# EAGLE design mainboard (EAGLE 5.07)

## Sheet 1 of 4
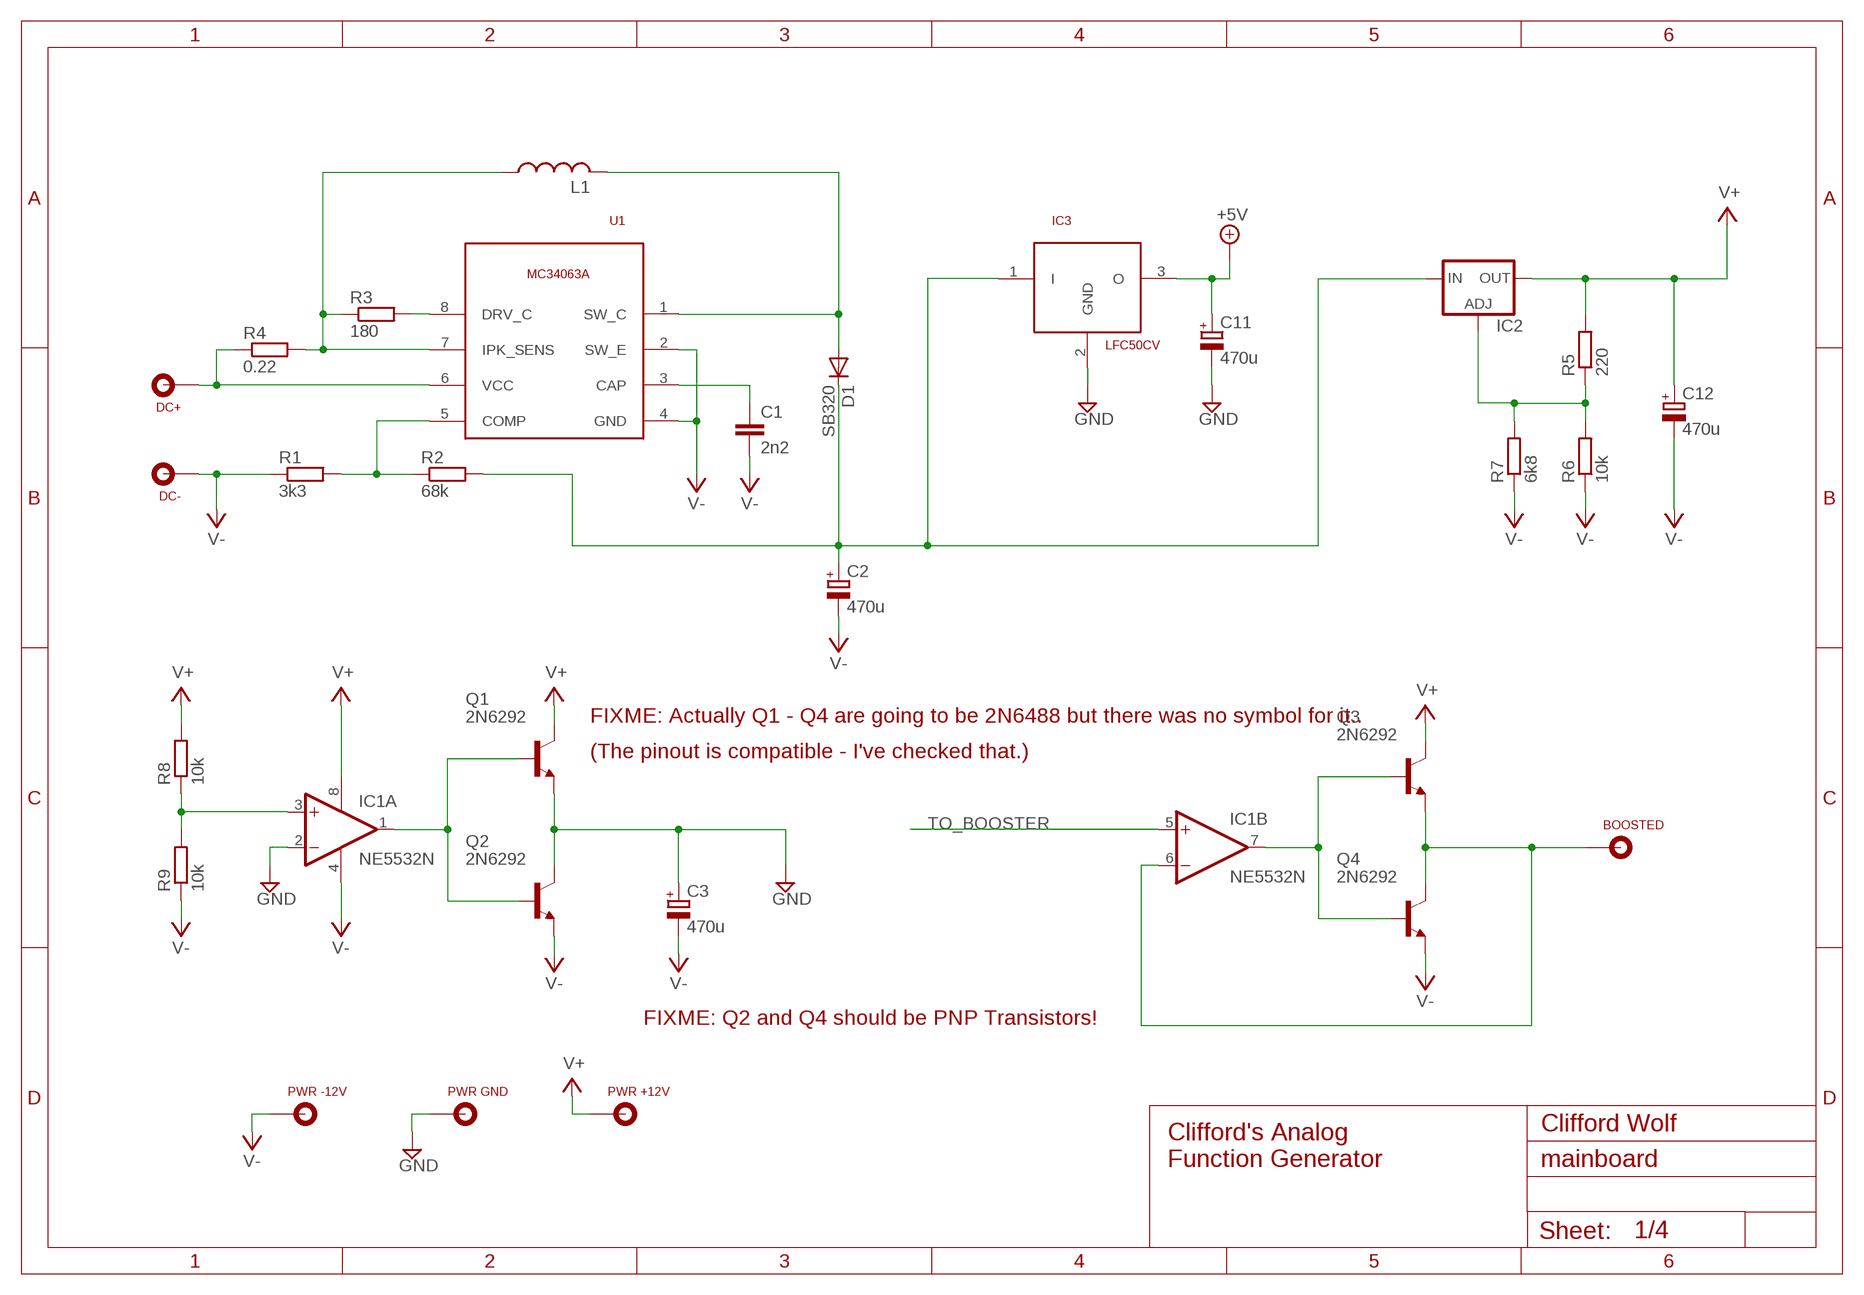
[diagram p0: schematic, sheet 1]

### Parts
C1  2n2  C-EU050-025X075  [C050-025X075]
C2  470u  CPOL-EUE5-10.5  [E5-10,5]
C3  470u  CPOL-EUE5-10.5  [E5-10,5]
C11  470u  CPOL-EUE5-10.5  [E5-10,5]
C12  470u  CPOL-EUE5-10.5  [E5-10,5]
CONN1  DC+  LABCONN  [LABCONN]
CONN2  DC-  LABCONN  [LABCONN]
CONN3  BOOSTED  LABCONN  [LABCONN]
CONN4  PWR -12V  LABCONN  [LABCONN]
CONN5  PWR GND  LABCONN  [LABCONN]
CONN6  PWR +12V  LABCONN  [LABCONN]
D1  SB320  [DO201-15]
IC1  NE5532N  [DIL08]
IC2  LM317TL  [317TL]
IC3  LFC50CV  [TO220L1]
L1  L-US0207/12  [0207/12]
Q1  2N6292  [TO220]
Q2  2N6292  [TO220]
Q3  2N6292  [TO220]
Q4  2N6292  [TO220]
R1  3k3  R-EU_0207/7  [0207/7]
R2  68k  R-EU_0207/7  [0207/7]
R3  180  R-EU_0207/7  [0207/7]
R4  0.22  R-EU_0207/7  [0207/7]
R5  220  R-EU_0207/7  [0207/7]
R6  10k  R-EU_0207/7  [0207/7]
R7  6k8  R-EU_0207/7  [0207/7]
R8  10k  R-EU_0207/7  [0207/7]
R9  10k  R-EU_0207/7  [0207/7]
U1  MC34063A  [DIL08]

### Nets
+5V [power]: C11.+ IC3.3(O) ; also sheet 3,4
GND [power]: C3.+ C11.- CONN5.P$1 IC1.2(A:-IN) IC3.2(GND) Q1.3(E) Q2.2(C) ; also sheet 2,3,4
N$2: R1.2 R2.1 U1.5(COMP)
N$3 [power]: CONN1.P$1 R4.1 U1.6(VCC)
N$4 [power]: L1.1 R3.1 R4.2 U1.7(IPK_SENS)
N$5: R3.2 U1.8(DRV_C)
N$6 [power]: D1.A L1.2 U1.1(SW_C)
N$8: C1.1 U1.3(CAP)
N$9: IC2.1(ADJ) R5.1 R6.2 R7.2
N$10 [power]: C2.+ D1.C IC2.3(IN) IC3.1(I) R2.2
N$11: IC1.3(A:+IN) R8.1 R9.2
N$12: IC1.1(A:OUT) Q1.1(B) Q2.1(B)
N$13: CONN3.P$1 IC1.6(B:-IN) Q3.3(E) Q4.2(C)
N$15: IC1.7(B:OUT) Q3.1(B) Q4.1(B)
TO_BOOSTER: IC1.5(B:+IN) ; also sheet 2
V+ [power]: C12.+ CONN6.P$1 IC1.8(P:V+) IC2.2(OUT) Q1.2(C) Q3.2(C) R5.2 R8.2 ; also sheet 2,3,4
V- [power]: C1.2 C2.- C3.- C12.- CONN2.P$1 CONN4.P$1 IC1.4(P:V-) Q2.3(E) Q4.3(E) R1.1 R6.1 R7.1 R9.1 U1.2(SW_E) U1.4(GND) ; also sheet 2,3,4

### Notes on the sheet
- FIXME: Actually Q1 - Q4 are going to be 2N6488 but there was no symbol for it..
- (The pinout is compatible - I've checked that.)
- FIXME: Q2 and Q4 should be PNP Transistors!
- Clifford Wolf
- Clifford's Analog
- Function Generator

## Sheet 2 of 4
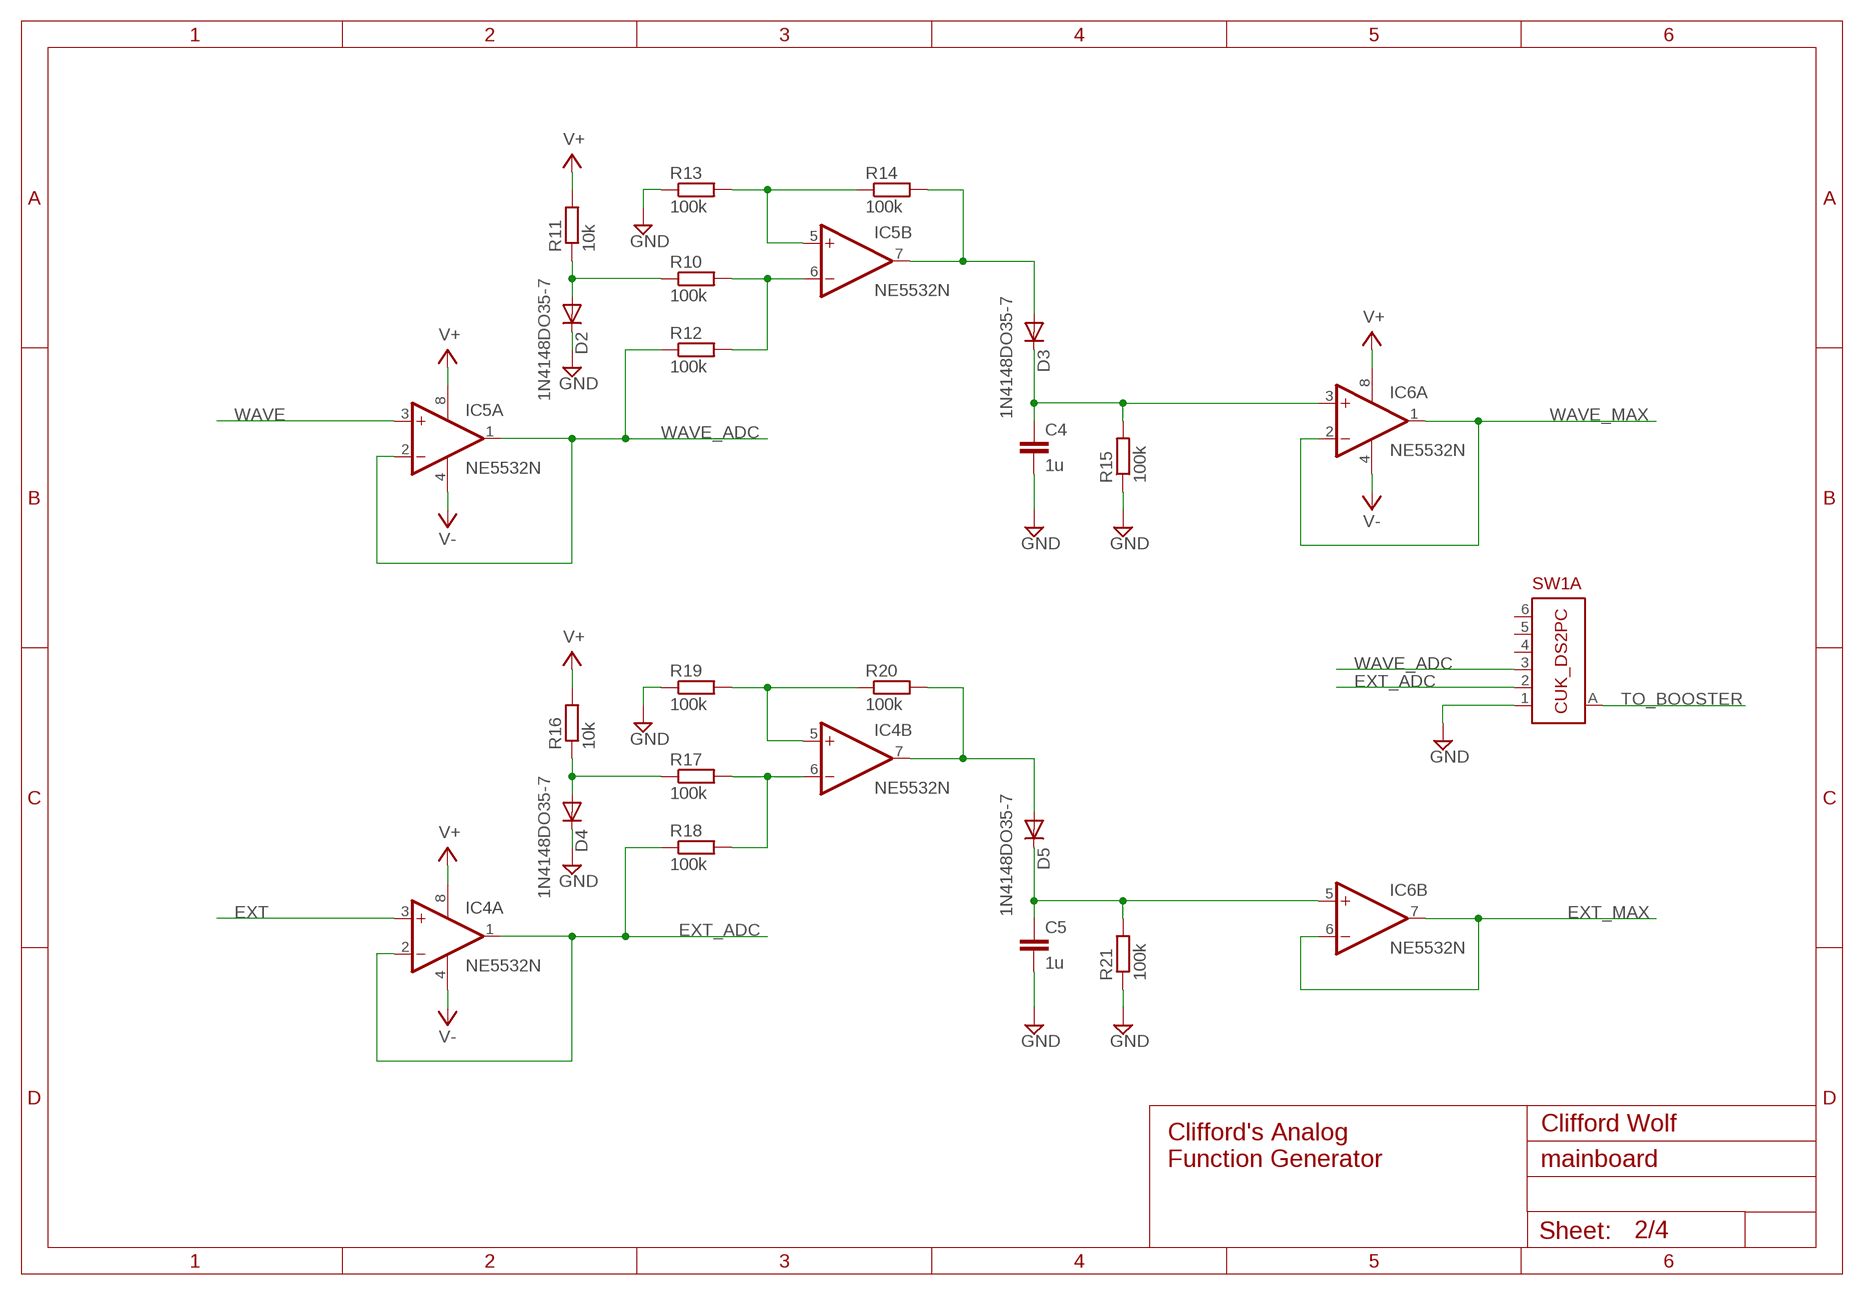
[diagram p1: schematic, sheet 2]

### Parts
C4  1u  C-EU050-025X075  [C050-025X075]
C5  1u  C-EU050-025X075  [C050-025X075]
D2  1N4148DO35-7  [DO35-7]
D3  1N4148DO35-7  [DO35-7]
D4  1N4148DO35-7  [DO35-7]
D5  1N4148DO35-7  [DO35-7]
IC4  NE5532N  [DIL08]
IC5  NE5532N  [DIL08]
IC6  NE5532N  [DIL08]
R10  100k  R-EU_0207/7  [0207/7]
R11  10k  R-EU_0207/7  [0207/7]
R12  100k  R-EU_0207/7  [0207/7]
R13  100k  R-EU_0207/7  [0207/7]
R14  100k  R-EU_0207/7  [0207/7]
R15  100k  R-EU_0207/7  [0207/7]
R16  10k  R-EU_0207/7  [0207/7]
R17  100k  R-EU_0207/7  [0207/7]
R18  100k  R-EU_0207/7  [0207/7]
R19  100k  R-EU_0207/7  [0207/7]
R20  100k  R-EU_0207/7  [0207/7]
R21  100k  R-EU_0207/7  [0207/7]
SW1  CUK_DS2PC  [CUK_DS2PC]

### Nets
EXT: IC4.3(A:+IN) ; also sheet 4
EXT_ADC: IC4.1(A:OUT) IC4.2(A:-IN) R18.1 SW1.2(A:IN2) ; also sheet 4
EXT_MAX: IC6.6(B:-IN) IC6.7(B:OUT) ; also sheet 4
GND [power]: C4.2 C5.2 D2.C D4.C R13.1 R15.1 R19.1 R21.1 SW1.1(A:IN1) ; also sheet 1,3,4
N$17: D2.A R10.1 R11.1
N$18: IC5.6(B:-IN) R10.2 R12.2
N$20: IC5.5(B:+IN) R13.2 R14.1
N$21: D3.A IC5.7(B:OUT) R14.2
N$22: C4.1 D3.C IC6.3(A:+IN) R15.2
N$26: D4.A R16.1 R17.1
N$27: IC4.6(B:-IN) R17.2 R18.2
N$28: IC4.5(B:+IN) R19.2 R20.1
N$29: D5.A IC4.7(B:OUT) R20.2
N$30: C5.1 D5.C IC6.5(B:+IN) R21.2
TO_BOOSTER: SW1.A(A:OUT) ; also sheet 1
V+ [power]: IC4.8(P:V+) IC5.8(P:V+) IC6.8(P:V+) R11.2 R16.2 ; also sheet 1,3,4
V- [power]: IC4.4(P:V-) IC5.4(P:V-) IC6.4(P:V-) ; also sheet 1,3,4
WAVE: IC5.3(A:+IN) ; also sheet 4
WAVE_ADC: IC5.1(A:OUT) IC5.2(A:-IN) R12.1 SW1.3(A:IN3) ; also sheet 4
WAVE_MAX: IC6.1(A:OUT) IC6.2(A:-IN) ; also sheet 4
Unconnected: SW1.4(A:IN4) SW1.5(A:IN5) SW1.6(A:IN6) SW1.7(C:IN1) SW1.8(C:IN2) SW1.9(C:IN3) SW1.10(C:IN4) SW1.11(C:IN5) SW1.12(C:IN6) SW1.C(C:OUT)

### Notes on the sheet
- Clifford Wolf
- Clifford's Analog
- Function Generator

## Sheet 3 of 4
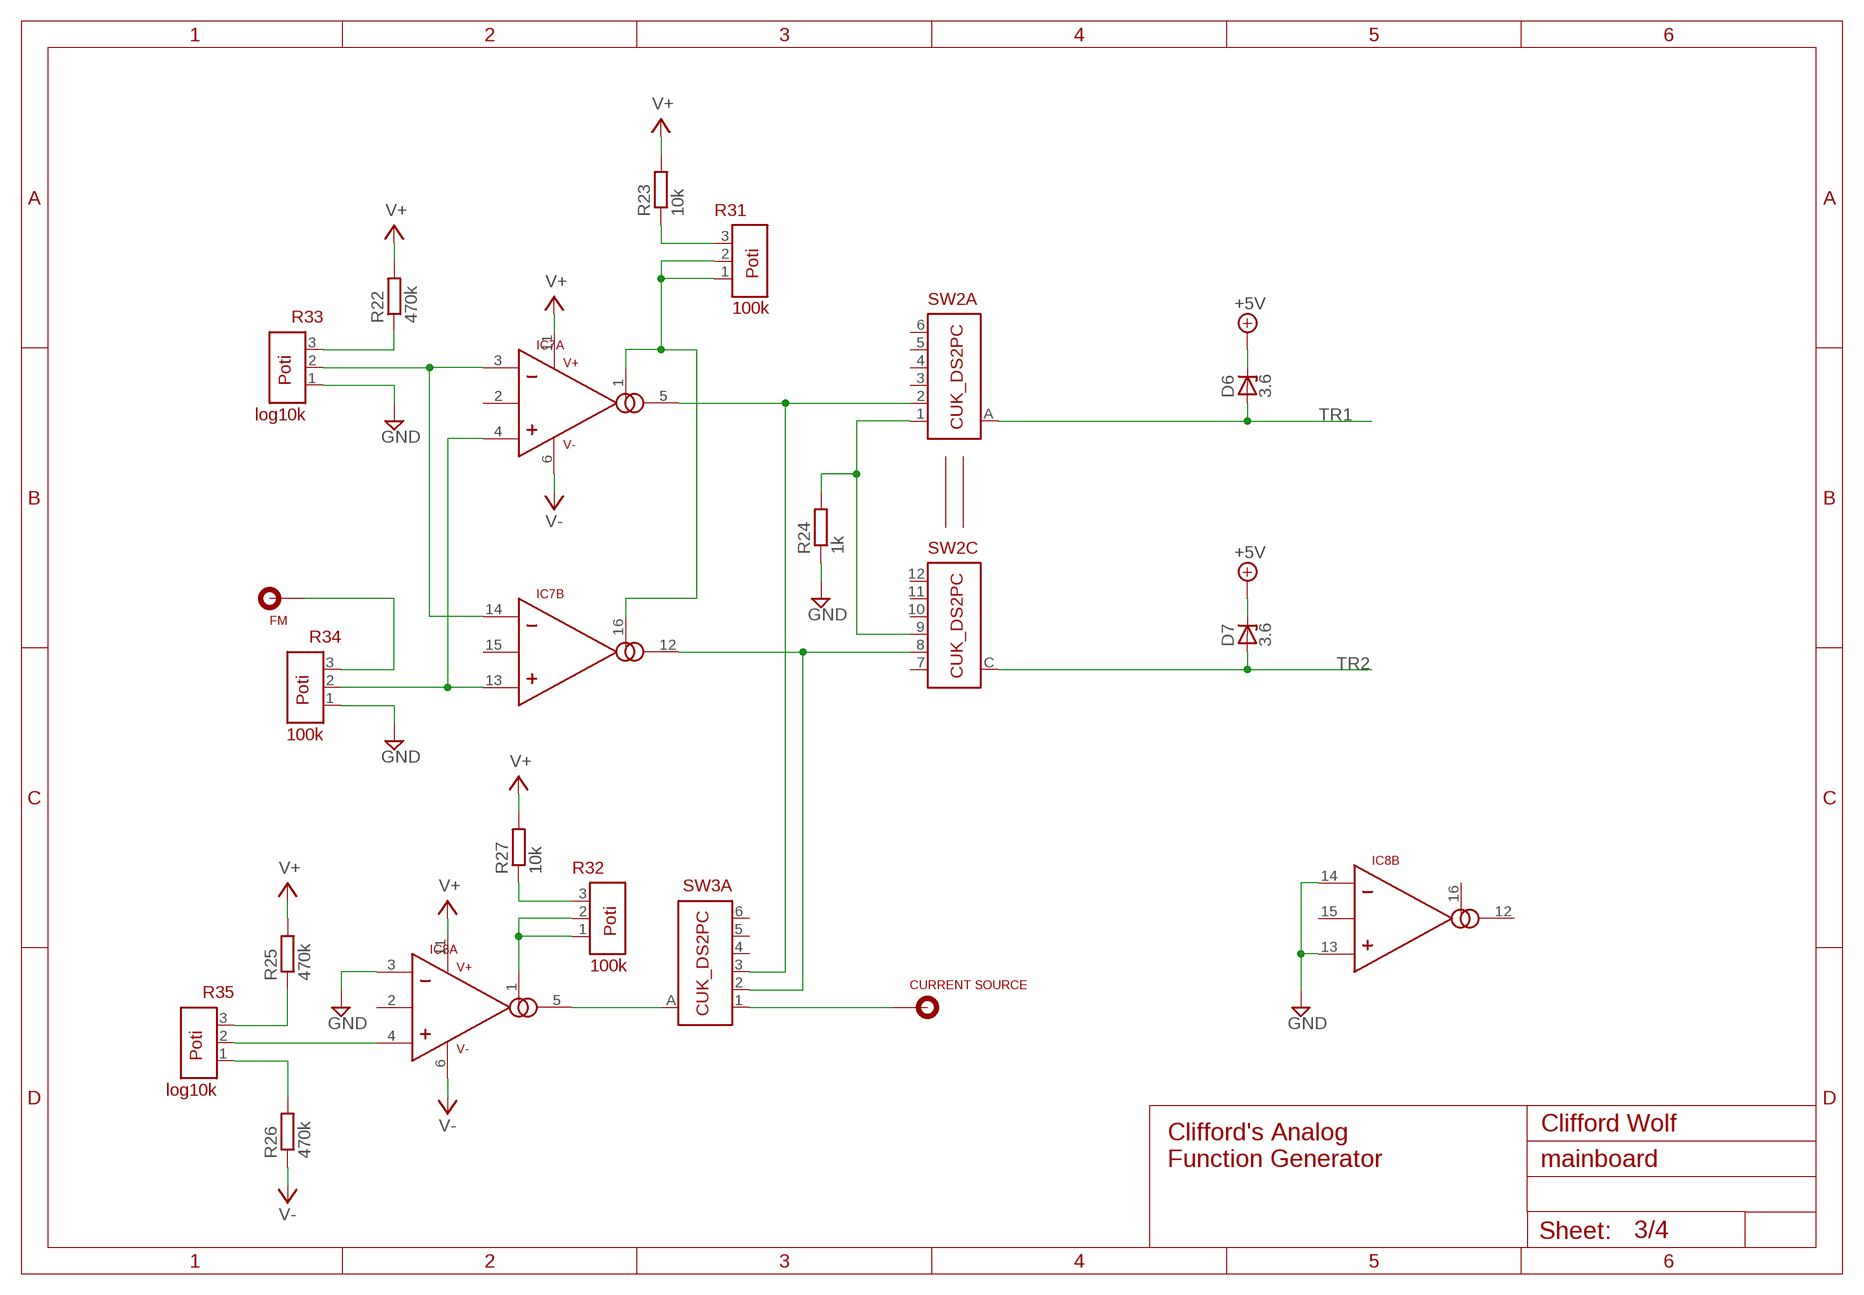
[diagram p2: schematic, sheet 3]

### Parts
CONN7  FM  LABCONN  [LABCONN]
CONN8  CURRENT SOURCE  LABCONN  [LABCONN]
D6  3.6  ZENER-DIODEZD-7.5  [ZDIO-7.5]
D7  3.6  ZENER-DIODEZD-7.5  [ZDIO-7.5]
IC7  LM13700  [DIL16]
IC8  LM13700  [DIL16]
R22  470k  R-EU_0207/7  [0207/7]
R23  10k  R-EU_0207/7  [0207/7]
R24  1k  R-EU_0207/7  [0207/7]
R25  470k  R-EU_0207/7  [0207/7]
R26  470k  R-EU_0207/7  [0207/7]
R27  10k  R-EU_0207/7  [0207/7]
R31  100k  ALPS_RK09K113  [ALPS_RK09K113]
R32  100k  ALPS_RK09K113  [ALPS_RK09K113]
R33  log10k  ALPS_RK09K113  [ALPS_RK09K113]
R34  100k  ALPS_RK09K113  [ALPS_RK09K113]
R35  log10k  ALPS_RK09K113  [ALPS_RK09K113]
SW2  CUK_DS2PC  [CUK_DS2PC]
SW3  CUK_DS2PC  [CUK_DS2PC]

### Nets
+5V [power]: D6.C D7.C ; also sheet 1,4
GND [power]: IC8.3(A:+) IC8.13(B:-) IC8.14(B:+) R24.1 R33.1 R34.1 ; also sheet 1,2,4
N$7: IC8.5(A:OUT) SW3.A(A:OUT)
N$14: R22.1 R33.3
N$16: IC7.4(A:-) IC7.13(B:-) R34.2
N$19: IC7.5(A:OUT) SW2.2(A:IN2) SW3.3(A:IN3)
N$23: CONN7.P$1 R34.3
N$24 [power]: IC7.3(A:+) IC7.14(B:+) R33.2
N$25: IC7.1(A:AMP_BIAS) IC7.16(B:AMP_BIAS) R31.1 R31.2
N$31: R23.1 R31.3
N$32: IC7.12(B:OUT) SW2.8(C:IN2) SW3.2(A:IN2)
N$33: R24.2 SW2.1(A:IN1) SW2.9(C:IN3)
N$34: IC8.4(A:-) R35.2
N$35: R26.2 R35.1
N$36: R25.1 R35.3
N$38: CONN8.P$1 SW3.1(A:IN1)
N$39: IC8.1(A:AMP_BIAS) R32.1 R32.2
N$40: R27.1 R32.3
TR1: D6.A SW2.A(A:OUT) ; also sheet 4
TR2: D7.A SW2.C(C:OUT) ; also sheet 4
V+ [power]: IC7.11(Z:V+) IC8.11(Z:V+) R22.2 R23.2 R25.2 R27.2 ; also sheet 1,2,4
V- [power]: IC7.6(Z:V-) IC8.6(Z:V-) R26.1 ; also sheet 1,2,4
Unconnected: IC7.2(A:DIODE_BIAS) IC7.7(X:INPUT) IC7.8(X:OUTPUT) IC7.9(Y:OUTPUT) IC7.10(Y:INPUT) IC7.15(B:DIODE_BIAS) IC8.2(A:DIODE_BIAS) IC8.7(X:INPUT) IC8.8(X:OUTPUT) IC8.9(Y:OUTPUT) IC8.10(Y:INPUT) IC8.12(B:OUT) IC8.15(B:DIODE_BIAS) IC8.16(B:AMP_BIAS) SW2.3(A:IN3) SW2.4(A:IN4) SW2.5(A:IN5) SW2.6(A:IN6) SW2.7(C:IN1) SW2.10(C:IN4) SW2.11(C:IN5) SW2.12(C:IN6) SW3.4(A:IN4) SW3.5(A:IN5) SW3.6(A:IN6) SW3.7(C:IN1) SW3.8(C:IN2) SW3.9(C:IN3) SW3.10(C:IN4) SW3.11(C:IN5) SW3.12(C:IN6) SW3.C(C:OUT)

### Notes on the sheet
- Clifford Wolf
- Clifford's Analog
- Function Generator

## Sheet 4 of 4
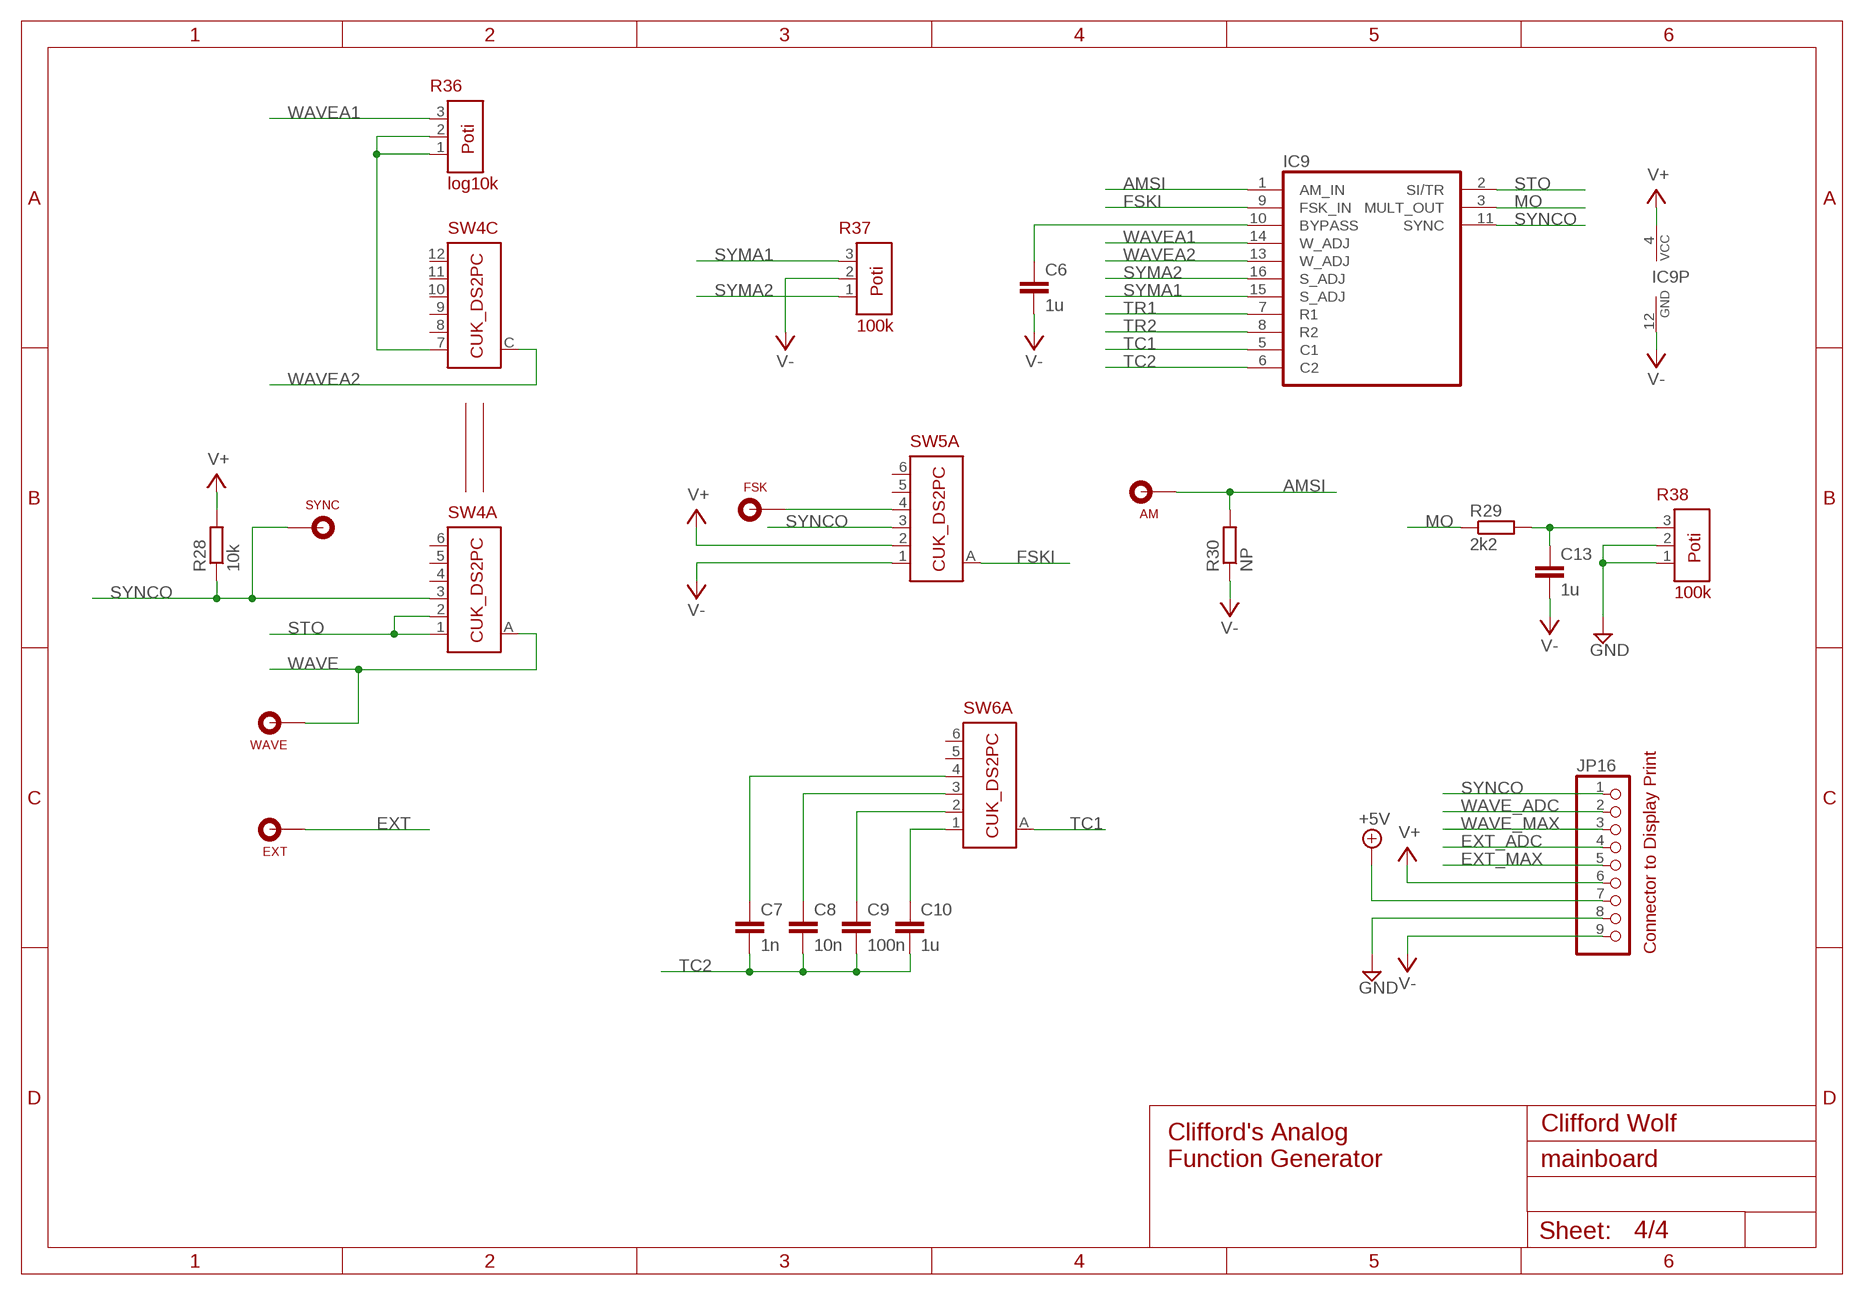
[diagram p3: schematic, sheet 4]

### Parts
C6  1u  C-EU050-025X075  [C050-025X075]
C7  1n  C-EU050-025X075  [C050-025X075]
C8  10n  C-EU050-025X075  [C050-025X075]
C9  100n  C-EU050-025X075  [C050-025X075]
C10  1u  C-EU050-025X075  [C050-025X075]
C13  1u  C-EU050-025X075  [C050-025X075]
CONN9  SYNC  LABCONN  [LABCONN]
CONN10  WAVE  LABCONN  [LABCONN]
CONN11  AM  LABCONN  [LABCONN]
CONN12  FSK  LABCONN  [LABCONN]
CONN13  EXT  LABCONN  [LABCONN]
IC9  XR-2206  [DIL16]
JP16  PINHD-1X9  [1X09]
R28  10k  R-EU_0207/7  [0207/7]
R29  2k2  R-EU_0207/7  [0207/7]
R30  NP  R-EU_0207/7  [0207/7]
R36  log10k  ALPS_RK09K113  [ALPS_RK09K113]
R37  100k  ALPS_RK09K113  [ALPS_RK09K113]
R38  100k  ALPS_RK09K113  [ALPS_RK09K113]
SW4  CUK_DS2PC  [CUK_DS2PC]
SW5  CUK_DS2PC  [CUK_DS2PC]
SW6  CUK_DS2PC  [CUK_DS2PC]

### Nets
+5V [power]: JP16.7 ; also sheet 1,3
AMSI: CONN11.P$1 IC9.1(AM_IN) R30.2
EXT: CONN13.P$1 ; also sheet 2
EXT_ADC: JP16.4 ; also sheet 2
EXT_MAX: JP16.5 ; also sheet 2
FSKI: IC9.9(FSK_IN) SW5.A(A:OUT)
GND [power]: JP16.8 R38.1 R38.2 ; also sheet 1,2,3
MO: IC9.3(MULT_OUT) R29.1
N$1: C6.1 IC9.10(BYPASS)
N$41: R36.1 R36.2 SW4.7(C:IN1)
N$42: C13.1 R29.2 R38.3
N$43: CONN12.P$1 SW5.4(A:IN4)
N$44: C7.1 SW6.4(A:IN4)
N$45: C8.1 SW6.3(A:IN3)
N$46: C9.1 SW6.2(A:IN2)
N$47: C10.1 SW6.1(A:IN1)
STO: IC9.2(SI/TR) SW4.1(A:IN1) SW4.2(A:IN2)
SYMA1: IC9.15(S_ADJ) R37.3
SYMA2: IC9.16(S_ADJ) R37.1
SYNCO: CONN9.P$1 IC9.11(SYNC) JP16.1 R28.1 SW4.3(A:IN3) SW5.3(A:IN3)
TC1: IC9.5(C1) SW6.A(A:OUT)
TC2: C7.2 C8.2 C9.2 C10.2 IC9.6(C2)
TR1: IC9.7(R1) ; also sheet 3
TR2: IC9.8(R2) ; also sheet 3
V+ [power]: IC9.4(VCC) JP16.6 R28.2 SW5.2(A:IN2) ; also sheet 1,2,3
V- [power]: C6.2 C13.2 IC9.12(GND) JP16.9 R30.1 R37.2 SW5.1(A:IN1) ; also sheet 1,2,3
WAVE: CONN10.P$1 SW4.A(A:OUT) ; also sheet 2
WAVE_ADC: JP16.2 ; also sheet 2
WAVE_MAX: JP16.3 ; also sheet 2
WAVEA1: IC9.14(W_ADJ) R36.3
WAVEA2: IC9.13(W_ADJ) SW4.C(C:OUT)
Unconnected: SW4.4(A:IN4) SW4.5(A:IN5) SW4.6(A:IN6) SW4.8(C:IN2) SW4.9(C:IN3) SW4.10(C:IN4) SW4.11(C:IN5) SW4.12(C:IN6) SW5.5(A:IN5) SW5.6(A:IN6) SW5.7(C:IN1) SW5.8(C:IN2) SW5.9(C:IN3) SW5.10(C:IN4) SW5.11(C:IN5) SW5.12(C:IN6) SW5.C(C:OUT) SW6.5(A:IN5) SW6.6(A:IN6) SW6.7(C:IN1) SW6.8(C:IN2) SW6.9(C:IN3) SW6.10(C:IN4) SW6.11(C:IN5) SW6.12(C:IN6) SW6.C(C:OUT)

### Notes on the sheet
- Connector to Display Print
- Clifford Wolf
- Clifford's Analog
- Function Generator

## Library data of the parts
C1 C4-C10 C13 = resistor:C-EU: CAPACITOR, European symbol
C2 C3 C11 C12 = resistor:CPOL-EU: POLARIZED CAPACITOR, European symbol
CONN1-CONN13 = parts:LABCONN
D1 = diode:SB320: DIODE barrier rectifier, 3 A (Fairchild)
D2-D5 = diode:1N4148: DIODE high speed (Philips)
D6 D7 = diode:ZENER-DIODE: Z-Diode
IC1 IC4-IC6 = linear:NE5532: AUDIO AMPLIFIER
IC2 = v-reg:LM317TL: VOLTAGE REGULATOR
IC3 = parts:LFC50CV
IC7 IC8 = parts:LM13700
IC9 = exar:XR-2206: Monolithic FUNCTION GENERATOR
JP16 = pinhead:PINHD-1X9: PIN HEADER
L1 = resistor:L-US: INDUCTOR, American symbol
Q1-Q4 = transistor-npn:2N6292: NPN Transistor
R1-R30 = resistor:R-EU_: RESISTOR, European symbol
R31-R38 = parts:ALPS_RK09K113
SW1-SW6 = parts:CUK_DS2PC
U1 = parts:MC34063A

## Net classes
0 default: width 0.254 mm
1 power: width 0.762 mm

## Board
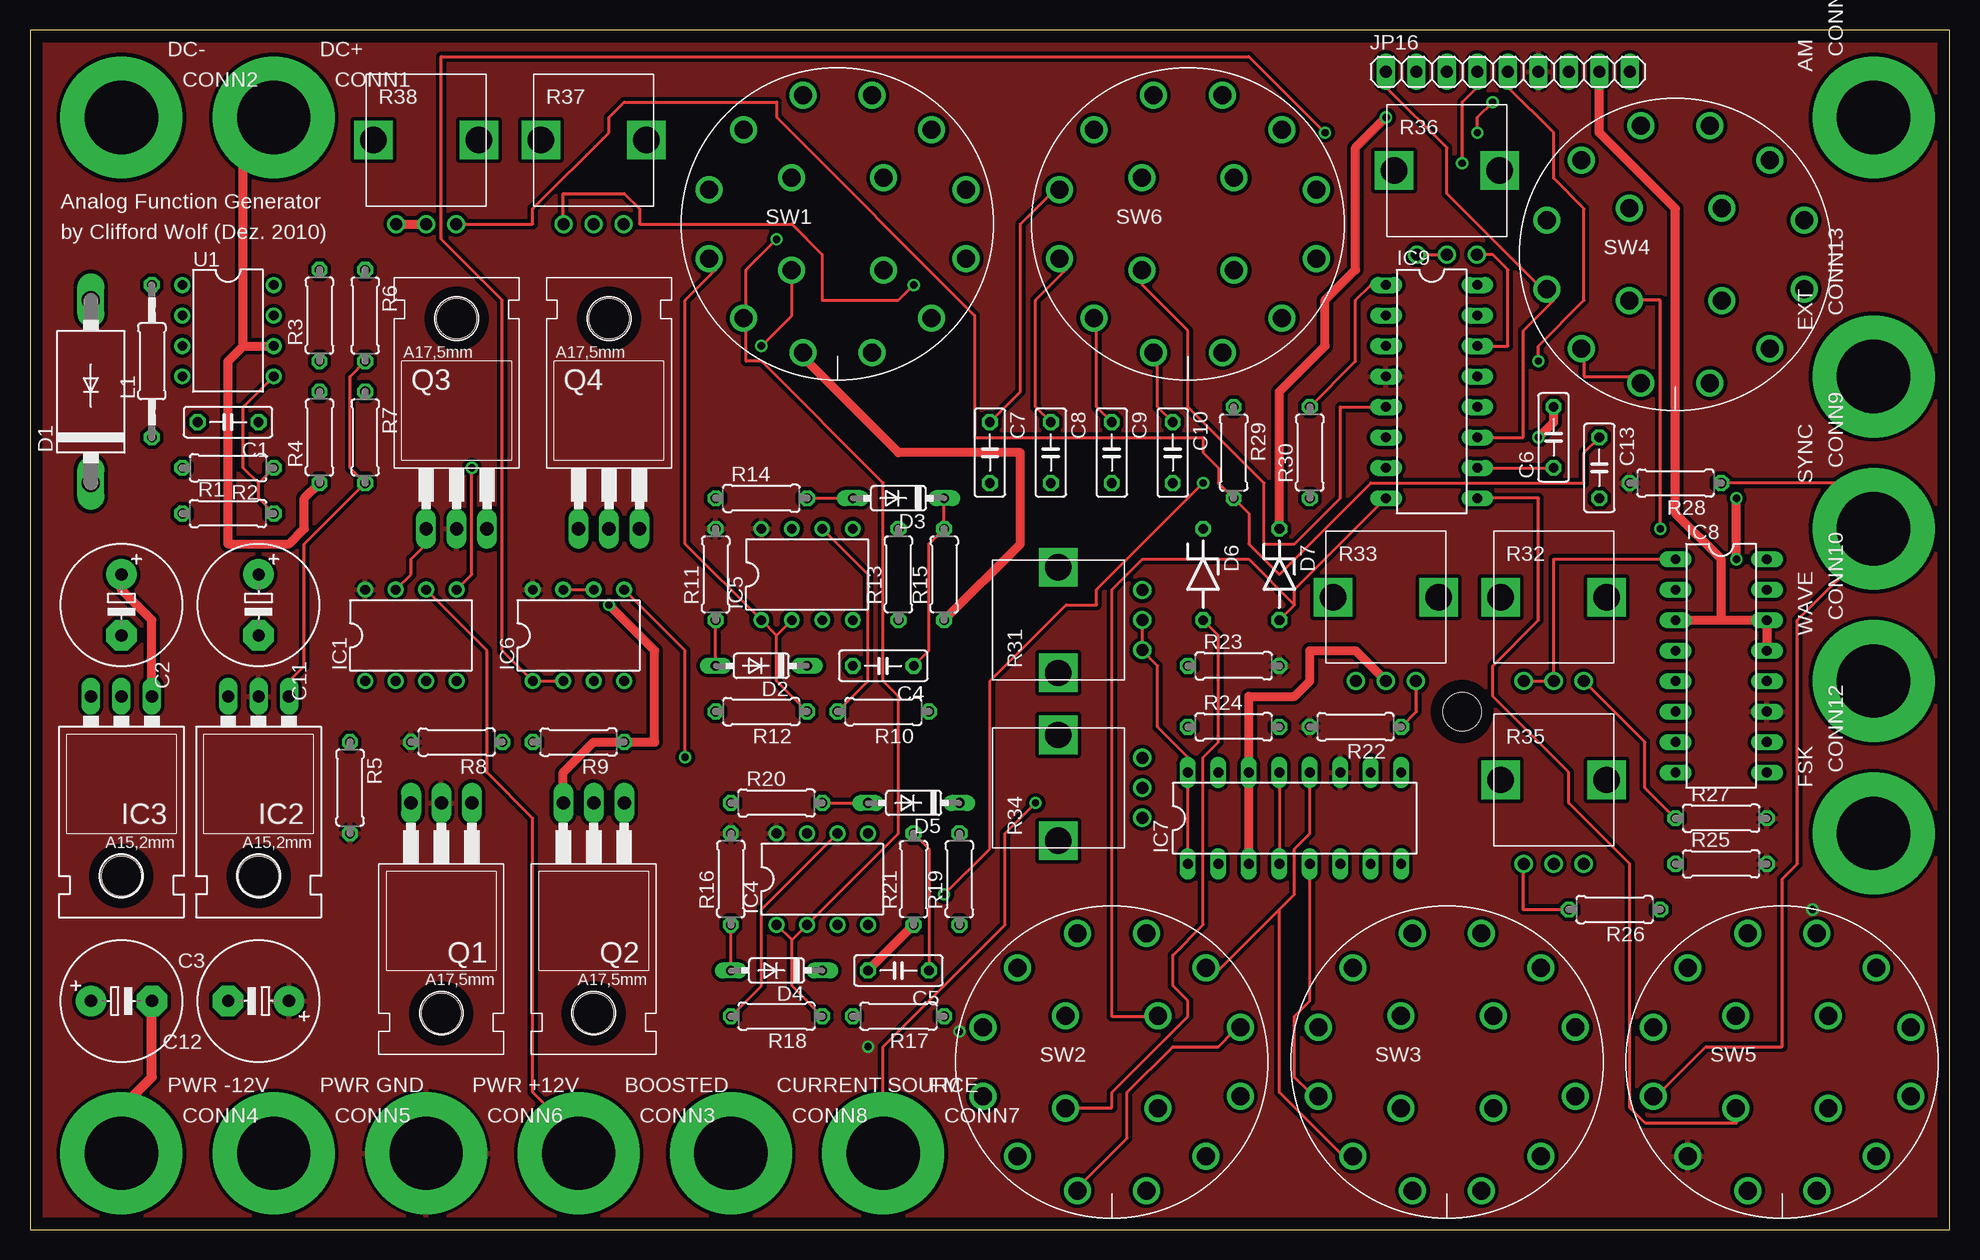
[diagram p4: board, top side]
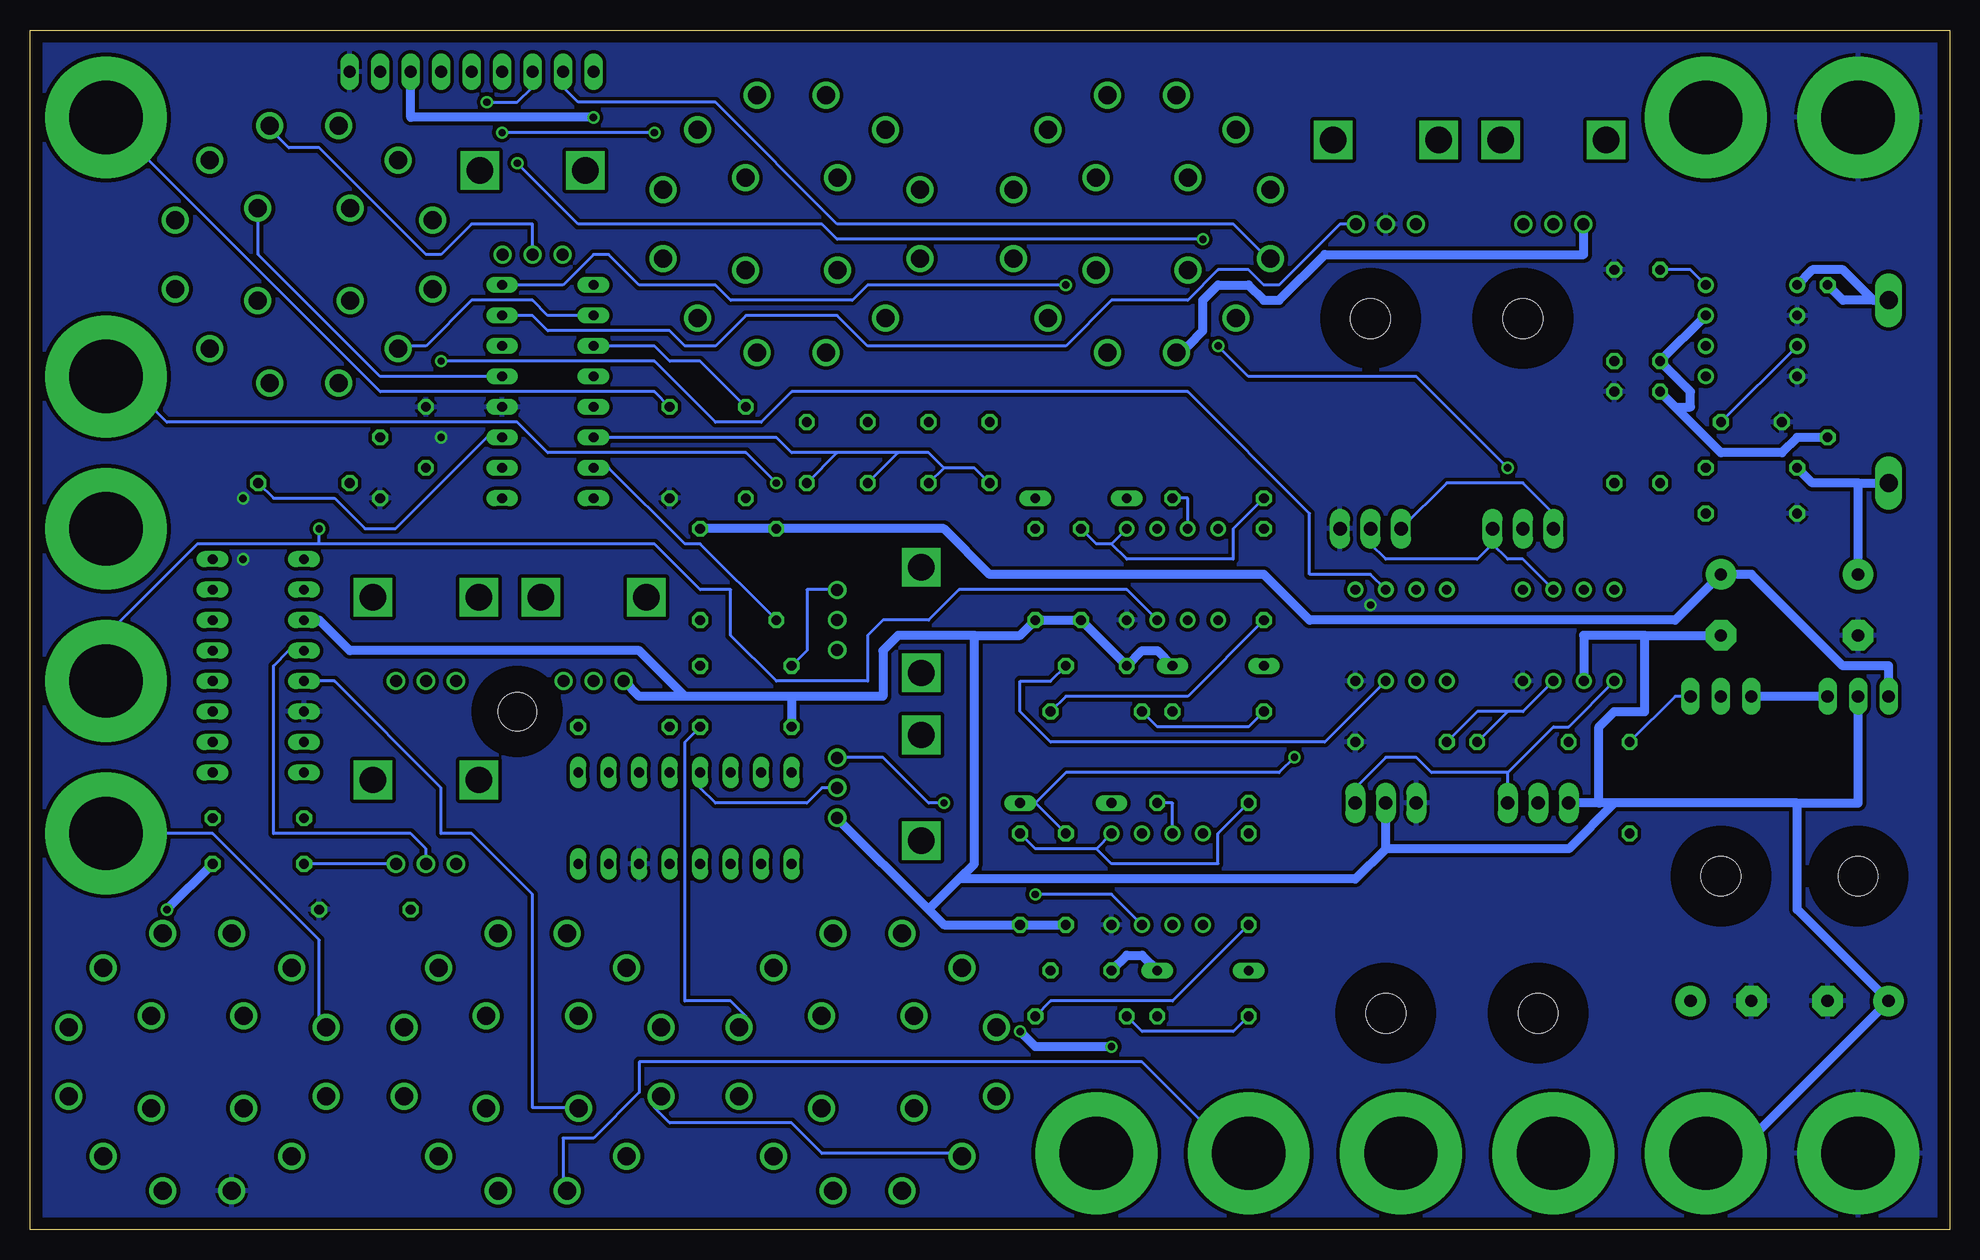
[diagram p5: board, bottom side, seen from below]

Size 160 x 100 mm. Coordinates in mm from the lower left corner, seen from the top.
Outline: 0,0 160,0 160,100 0,100 0,0
Copper layers (1*16): Top 0.035mm / dielectric 1.5mm / Bottom 0.035mm
Design rules "default *": minimum track width 10mil, minimum drill 24mil, track to track 12mil, track to pad 12mil, pad to pad 12mil, via to via 12mil, smd to smd 8mil, copper to edge 40mil, drill to drill 8mil, minimum pad ring 10mil, minimum via ring 8mil, stop-mask expansion 4mil, vias tented up to drill 0mil, thermal gap 10mil
Holes 3.2 mm at 119.38,43.18
bRestrict: area 115.8,39.6 to 123,46.8

### Footprints (pad centres in the part's own frame; a part is rotated, then mirrored left to right if it is on the bottom)
C050-025X075 = drill 0.813 octagon: 1 -2.54,0; 2 2.54,0
E5-10,5 = drill 1.016 pad 2.54 round: + -2.54,0 | drill 1.016 pad 2.54 octagon: - 2.54,0
LABCONN = drill 6.096 pad 10.16 round: P$1 0,0
DO201-15 = drill 1.499 long: A 7.62,0; C -7.62,0
DO35-7 = drill 0.813 long: A 3.81,0; C -3.81,0
ZDIO-7.5 = drill 0.813 octagon: A 3.81,0; C -3.81,0
DIL08 = drill 0.813 pad 1.27 round: 1 -3.81,-3.81; 2 -1.27,-3.81; 3 1.27,-3.81; 4 3.81,-3.81; 5 3.81,3.81; 6 1.27,3.81; 7 -1.27,3.81; 8 -3.81,3.81
317TL = drill 1.016 long: 1 -2.54,-3.81; 2 0,-3.81; 3 2.54,-3.81 | hole 3.302: 0,11.176
TO220L1 = drill 1.016 long: 1 -2.54,-3.81; 2 0,-3.81; 3 2.54,-3.81 | hole 3.302: 0,11.176
DIL16 = drill 0.813 long: 1 -8.89,-3.81; 2 -6.35,-3.81; 3 -3.81,-3.81; 4 -1.27,-3.81; 5 1.27,-3.81; 6 3.81,-3.81; 7 6.35,-3.81; 8 8.89,-3.81; 9 8.89,3.81; 10 6.35,3.81; 11 3.81,3.81; 12 1.27,3.81; 13 -1.27,3.81; 14 -3.81,3.81; 15 -6.35,3.81; 16 -8.89,3.81
1X09 = drill 1.016 long: 1 -10.16,0; 2 -7.62,0; 3 -5.08,0; 4 -2.54,0; 5 0,0; 6 2.54,0; 7 5.08,0; 8 7.62,0; 9 10.16,0
0207/12 = drill 0.813 octagon: 1 -6.35,0; 2 6.35,0
TO220 = drill 1.118 long: 1 -2.54,-6.35; 2 0,-6.35; 3 2.54,-6.35 | hole 3.302: 0,11.176
0207/7 = drill 0.813 octagon: 1 -3.81,0; 2 3.81,0
ALPS_RK09K113 = drill 1 round: 1 -2.5,0; 2 0,0; 3 2.5,0 | drill 2.2 square: NC1 -4.4,7; NC2 4.4,7
CUK_DS2PC = drill 1.5 round: 1 -2.873,-10.722; 2 -7.848,-7.848; 3 -10.722,-2.873; 4 -10.722,2.873; 5 -7.848,7.848; 6 -2.873,10.722; 7 2.873,10.722; 8 7.848,7.848; 9 10.722,2.873; 10 10.722,-2.873; 11 7.848,-7.848; 12 2.873,-10.722; A -3.85,-3.85; B -3.85,3.85; C 3.85,3.85; D 3.85,-3.85

### Placement (x,y rotation side)
C1  16.51,67.31 180 top
C2  7.62,52.07 270 top
C3  7.62,19.05 0 top
C4  71.12,46.99 180 top
C5  72.39,21.59 180 top
C6  127,66.04 90 top
C7  80.01,64.77 270 top
C8  85.09,64.77 270 top
C9  90.17,64.77 270 top
C10  95.25,64.77 270 top
C11  19.05,52.07 270 top
C12  19.05,19.05 180 top
C13  130.81,63.5 270 top
CONN1  20.32,92.71 0 top
CONN2  7.62,92.71 0 top
CONN3  45.72,6.35 0 top
CONN4  7.62,6.35 0 top
CONN5  20.32,6.35 0 top
CONN6  33.02,6.35 0 top
CONN7  71.12,6.35 0 top
CONN8  58.42,6.35 0 top
CONN9  153.67,58.42 90 top
CONN10  153.67,45.72 90 top
CONN11  153.67,92.71 90 top
CONN12  153.67,33.02 90 top
CONN13  153.67,71.12 90 top
D1  5.08,69.85 90 top
D2  60.96,46.99 180 top
D3  72.39,60.96 180 top
D4  62.23,21.59 180 top
D5  73.66,35.56 180 top
D6  97.79,54.61 270 top
D7  104.14,54.61 270 top
IC1  31.75,49.53 0 top
IC2  19.05,40.64 180 top
IC3  7.62,40.64 180 top
IC4  66.04,29.21 0 top
IC5  64.77,54.61 0 top
IC6  45.72,49.53 0 top
IC7  105.41,34.29 0 top
IC8  140.97,46.99 270 top
IC9  116.84,69.85 270 top
JP16  123.19,96.52 0 top
L1  10.16,72.39 90 top
Q1  34.29,29.21 180 top
Q2  46.99,29.21 180 top
Q3  35.56,64.77 0 top
Q4  48.26,64.77 0 top
R1  16.51,59.69 0 top
R2  16.51,63.5 180 top
R3  24.13,76.2 90 top
R4  24.13,66.04 90 top
R5  26.67,36.83 270 top
R6  27.94,76.2 270 top
R7  27.94,66.04 270 top
R8  35.56,40.64 180 top
R9  45.72,40.64 180 top
R10  71.12,43.18 180 top
R11  57.15,54.61 90 top
R12  60.96,43.18 180 top
R13  72.39,54.61 90 top
R14  60.96,60.96 0 top
R15  76.2,54.61 90 top
R16  58.42,29.21 90 top
R17  72.39,17.78 180 top
R18  62.23,17.78 180 top
R19  77.47,29.21 90 top
R20  62.23,35.56 0 top
R21  73.66,29.21 90 top
R22  110.49,41.91 180 top
R23  100.33,46.99 0 top
R24  100.33,41.91 0 top
R25  140.97,30.48 0 top
R26  132.08,26.67 180 top
R27  140.97,34.29 0 top
R28  137.16,62.23 180 top
R29  100.33,64.77 270 top
R30  106.68,64.77 90 top
R31  92.71,50.8 90 top
R32  127,45.72 0 top
R33  113.03,45.72 0 top
R34  92.71,36.83 90 top
R35  127,30.48 0 top
R36  118.11,81.28 0 top
R37  46.99,83.82 0 top
R38  33.02,83.82 0 top
SW1  67.31,83.82 0 top
SW2  90.17,13.97 0 top
SW3  118.11,13.97 0 top
SW4  137.16,81.28 0 top
SW5  146.05,13.97 0 top
SW6  96.52,83.82 0 top
U1  16.51,74.93 270 top

### Tracks (layer width: path | path; a pad name or v marks a point on that pad's centre or on a via)
+5V  (via drill 0.61)
  Top 0.762: v113.03,92.71 110.49,90.17 110.49,80.01 107.95,77.47 107.95,73.66 104.14,69.85 D7.C
  Bottom 0.762: IC3.3 5.08,46.99 8.89,46.99 16.51,54.61 C11.+ 22.86,50.8 53.34,50.8 57.15,54.61 80.01,54.61 83.82,58.42 D6.C D7.C | JP16.7 128.27,92.71 v113.03,92.71
AMSI
  Top 0.254: R30.2 110.49,72.39 110.49,77.47 111.76,78.74 IC9.1
  Bottom 0.254: R30.2 107.95,69.85 130.81,69.85 CONN11.P$1
EXT  (via drill 0.61)
  Top 0.254: v76.2,27.94 80.01,31.75 80.01,45.72 86.36,52.07 88.9,52.07 88.9,53.34 v97.79,62.23
  Bottom 0.254: IC4.3 69.85,27.94 v76.2,27.94 | v97.79,62.23 100.33,64.77 116.84,64.77 119.38,67.31 148.59,67.31 152.4,71.12 CONN13.P$1
EXT_ADC  (via drill 0.61)
  Top 0.254: 63.5,24.13 IC4.1 | 63.5,24.13 63.5,20.32 R18.1 | 63.5,24.13 IC4.2 72.39,33.02 72.39,44.45 71.12,45.72 71.12,62.23 60.96,72.39 59.69,72.39 59.69,74.93 SW1.2 59.69,76.2 59.69,80.01 v62.23,82.55 | JP16.4 120.65,95.25 119.38,93.98 v119.38,88.9
  Bottom 0.254: v119.38,88.9 114.3,83.82 93.98,83.82 92.71,82.55 v62.23,82.55
EXT_MAX  (via drill 0.61)
  Top 0.254: IC6.7 IC6.6 | JP16.5 123.19,95.25 127,91.44 127,87.63 129.54,85.09 129.54,77.47 125.73,73.66 v125.73,72.39
  Bottom 0.254: v125.73,72.39 107.95,72.39 102.87,67.31 99.06,67.31 96.52,69.85 63.5,69.85 53.34,59.69 53.34,54.61 48.26,54.61 IC6.6
FSKI
  Top 0.254: IC9.9 125.73,60.96 125.73,50.8 121.92,46.99 121.92,44.45 128.27,38.1 128.27,35.56 133.35,30.48 133.35,10.16 134.62,8.89 142.24,8.89 142.24,10.16 SW5.A
GND
  Top 0.762: 140.97,50.8 IC8.14 IC8.13 | IC8.3 140.97,50.8 | JP16.8 130.81,91.44 137.16,85.09 137.16,59.69 140.97,55.88 140.97,50.8 | R38.2 R38.1 30.48,83.82 | R21.1 C5.2 | R15.1 82.55,57.15 82.55,64.77 72.39,64.77 64.77,72.39 SW1.1
  Bottom 0.762: CONN5.P$1 17.78,6.35 C3.+ 12.7,26.67 12.7,35.56 | IC1.2 30.48,49.53 25.4,49.53 | 25.4,49.53 C11.- | IC3.2 7.62,35.56 12.7,35.56 | 29.21,35.56 Q1.3 | 27.94,35.56 29.21,35.56 | 12.7,35.56 27.94,35.56 | 46.99,31.75 Q2.2 | 46.99,31.75 31.75,31.75 27.94,35.56 | 25.4,49.53 25.4,43.18 27.94,43.18 29.21,41.91 29.21,35.56 | R38.1 30.48,83.82 30.48,81.28 52.07,81.28 55.88,77.47 57.15,77.47 58.42,78.74 60.96,78.74 62.23,77.47 62.23,74.93 63.5,73.66 SW1.1 | D4.C 67.31,22.86 68.58,22.86 C5.2 | R21.1 R19.1 83.82,25.4 85.09,26.67 | 85.09,26.67 92.71,34.29 R34.1 | D2.C 66.04,48.26 67.31,48.26 C4.2 R13.1 R15.1 77.47,49.53 81.28,49.53 | 96.52,44.45 R24.1 | 105.41,44.45 109.22,44.45 110.49,45.72 R33.1 | 96.52,44.45 105.41,44.45 | 81.28,49.53 87.63,49.53 88.9,48.26 88.9,44.45 96.52,44.45 | 82.55,29.21 81.28,30.48 81.28,49.53 | 82.55,29.21 85.09,26.67 | IC8.3 135.89,50.8 133.35,48.26 109.22,48.26 105.41,44.45 | 46.99,31.75 49.53,29.21 82.55,29.21
MO
  Bottom 0.254: R29.1 104.14,72.39 106.68,72.39 107.95,73.66 IC9.3
N$1
  Top 0.254: IC9.10 C6.1
N$2
  Top 0.254: R1.2 19.05,60.96 19.05,62.23 | 19.05,62.23 R2.1 | U1.5 17.78,68.58 17.78,63.5 19.05,62.23
N$3
  Top 0.762: 17.78,73.66 U1.6 | 17.78,73.66 17.78,90.17 CONN1.P$1 | R4.1 22.86,60.96 22.86,58.42 21.59,57.15 16.51,57.15 16.51,72.39 17.78,73.66
N$4
  Bottom 0.762: L1.1 12.7,66.04 13.97,64.77 19.05,64.77 22.86,68.58 | 22.86,68.58 R4.2 | 22.86,68.58 21.59,68.58 21.59,69.85 R3.1 U1.7
N$5
  Bottom 0.254: U1.8 21.59,80.01 R3.2
N$6
  Bottom 0.762: L1.2 8.89,77.47 6.35,77.47 | D1.A 6.35,77.47 | U1.1 11.43,80.01 8.89,80.01 6.35,77.47
N$7
  Bottom 0.254: IC8.5 134.62,45.72 125.73,36.83 125.73,33.02 123.19,33.02 118.11,27.94 118.11,10.16 114.3,10.16 SW3.A
N$8
  Bottom 0.254: C1.1 U1.3
N$9
  Top 0.254: IC2.1 21.59,45.72 22.86,46.99 22.86,57.15 R7.2 26.67,63.5 26.67,71.12 R6.2
  Bottom 0.254: R5.1 22.86,44.45 IC2.1
N$10
  Top 0.762: IC3.1 10.16,50.8 7.62,53.34 C2.+
  Bottom 0.762: IC3.1 IC2.3 | R2.2 11.43,62.23 7.62,62.23 | 7.62,62.23 D1.C | C2.+ 7.62,62.23
N$11
  Bottom 0.254: 36.83,43.18 R8.1 | 36.83,43.18 35.56,43.18 IC1.3 | R9.2 39.37,43.18 36.83,43.18
N$12
  Bottom 0.254: IC1.1 31.75,41.91 33.02,41.91 36.83,38.1 | Q1.1 36.83,38.1 | Q2.1 49.53,36.83 46.99,39.37 44.45,39.37 43.18,38.1 36.83,38.1
N$13
  Top 0.254: IC1.6 38.1,48.26 38.1,38.1 41.91,34.29 41.91,11.43 45.72,7.62 CONN3.P$1
  Bottom 0.254: IC1.6 35.56,55.88 36.83,55.88 38.1,57.15 | Q4.2 48.26,57.15 46.99,55.88 39.37,55.88 38.1,57.15 | 38.1,57.15 Q3.3
N$14
  Top 0.254: R22.1 115.57,43.18 115.57,45.72 R33.3
N$15
  Top 0.254: IC1.7 31.75,54.61 31.75,55.88 33.02,57.15 Q3.1
  Bottom 0.254: Q4.1 41.91,62.23 35.56,62.23 33.02,59.69 Q3.1
N$16
  Top 0.254: IC7.13 IC7.4
  Bottom 0.254: R34.2 93.98,36.83 95.25,35.56 102.87,35.56 104.14,36.83 IC7.13
N$17
  Top 0.254: D2.A R11.1
  Bottom 0.254: R10.1 73.66,44.45 63.5,44.45 R11.1
N$18
  Top 0.254: IC5.6 69.85,54.61 69.85,45.72 R10.2
  Bottom 0.254: R12.2 58.42,41.91 66.04,41.91 R10.2
N$19
  Top 0.254: IC7.5 106.68,19.05 105.41,17.78 105.41,12.7 106.68,11.43 SW3.3
  Bottom 0.254: SW2.2 82.55,6.35 93.98,6.35 96.52,8.89 106.68,8.89 107.95,10.16 SW3.3
N$20
  Bottom 0.254: 69.85,57.15 IC5.5 | 69.85,57.15 71.12,57.15 R13.2 | R14.1 59.69,58.42 59.69,55.88 68.58,55.88 69.85,57.15
N$21
  Top 0.254: R14.2 D3.A
  Bottom 0.254: IC5.7 63.5,60.96 R14.2
N$22
  Top 0.254: D3.C R15.2 74.93,57.15 74.93,48.26 C4.1
  Bottom 0.254: IC6.3 52.07,40.64 74.93,40.64 77.47,43.18 77.47,45.72 74.93,45.72 C4.1
N$23  (via drill 0.61)
  Top 0.254: v83.82,35.56 81.28,33.02 81.28,25.4 71.12,15.24 CONN7.P$1
  Bottom 0.254: v83.82,35.56 85.09,35.56 88.9,39.37 92.71,39.37 R34.3
N$24
  Top 0.762: IC7.3 IC7.14 101.6,44.45 105.41,44.45 106.68,45.72 106.68,48.26 110.49,48.26 R33.2
N$25
  Top 0.254: R31.2 R31.1 92.71,48.26 93.98,46.99 93.98,41.91 96.52,39.37 IC7.16 IC7.1
N$26
  Top 0.254: D4.A R16.1
  Bottom 0.254: R17.1 74.93,19.05 64.77,19.05 R16.1
N$27
  Top 0.254: IC4.6 60.96,26.67 60.96,20.32 R18.2
  Bottom 0.254: R18.2 59.69,16.51 67.31,16.51 R17.2
N$28
  Bottom 0.254: 71.12,31.75 IC4.5 | 71.12,31.75 76.2,31.75 R19.2 | R20.1 60.96,33.02 60.96,30.48 69.85,30.48 71.12,31.75
N$29
  Top 0.254: R20.2 D5.A
  Bottom 0.254: IC4.7 64.77,35.56 R20.2
N$30  (via drill 0.61)
  Top 0.254: C5.1 74.93,31.75 R21.2 | IC6.5 54.61,48.26 v54.61,39.37
  Bottom 0.254: v54.61,39.37 55.88,38.1 73.66,38.1 76.2,35.56 | 76.2,35.56 R21.2 | 76.2,35.56 D5.C
N$31
  Bottom 0.254: R23.1 95.25,48.26 95.25,53.34 92.71,53.34 R31.3
N$32
  Top 0.254: IC7.12 106.68,33.02 105.41,31.75 105.41,27.94 104.14,26.67 | 104.14,26.67 99.06,21.59 SW2.8 | 104.14,26.67 104.14,11.43 109.22,6.35 SW3.2
N$33
  Top 0.254: SW2.1 87.63,3.81 91.44,7.62 91.44,11.43 95.25,15.24 99.06,15.24 100.33,16.51 SW2.9
  Bottom 0.254: R24.2 105.41,40.64 105.41,19.05 101.6,19.05 100.33,17.78 SW2.9
N$34
  Bottom 0.254: IC8.4 138.43,48.26 139.7,46.99 139.7,33.02 128.27,33.02 127,31.75 R35.2
N$35
  Top 0.254: R26.2 124.46,26.67 124.46,30.48 R35.1
N$36
  Bottom 0.254: R35.3 R25.1
N$38
  Bottom 0.254: CONN8.P$1 59.69,6.35 67.31,13.97 109.22,13.97 109.22,11.43 113.03,7.62 115.57,7.62 115.57,3.81 SW3.1
N$39
  Top 0.254: IC8.1 127,55.88 R32.2 R32.1 124.46,45.72
N$40
  Top 0.254: R27.1 134.62,36.83 134.62,40.64 129.54,45.72 R32.3
N$41
  Top 0.254: R36.2 R36.1 115.57,81.28
  Bottom 0.254: R36.2 118.11,83.82 123.19,83.82 125.73,81.28 127,81.28 135.89,90.17 138.43,90.17 139.7,91.44 SW4.7
N$42
  Top 0.254: C13.1 129.54,64.77 129.54,62.23 111.76,62.23 104.14,54.61 101.6,57.15 101.6,59.69 R29.2 99.06,62.23 99.06,63.5 97.79,64.77 97.79,66.04 78.74,66.04 78.74,76.2 62.23,92.71 62.23,93.98 49.53,93.98 48.26,92.71 48.26,91.44 41.91,85.09 41.91,83.82 R38.3
N$43
  Bottom 0.254: CONN12.P$1 144.78,33.02 135.89,24.13 135.89,17.78 SW5.4
N$44
  Top 0.254: C7.1 82.55,69.85 82.55,83.82 85.09,86.36 SW6.4
N$45
  Top 0.254: C8.1 83.82,68.58 83.82,77.47 86.36,80.01 SW6.3
N$46
  Top 0.254: C9.1 88.9,68.58 88.9,74.93 SW6.2
N$47
  Top 0.254: C10.1 93.98,68.58 93.98,72.39 SW6.1
STO
  Top 0.254: SW4.1 133.35,71.12 129.54,71.12 129.54,72.39 SW4.2
  Bottom 0.254: IC9.2 116.84,76.2 118.11,77.47 123.19,77.47 127,73.66 128.27,73.66 SW4.2
SYMA1
  Bottom 0.254: IC9.15 118.11,76.2 116.84,74.93 106.68,74.93 105.41,73.66 102.87,73.66 100.33,76.2 92.71,76.2 90.17,73.66 73.66,73.66 69.85,77.47 63.5,77.47 60.96,80.01 58.42,80.01 57.15,78.74 55.88,78.74 50.8,83.82 R37.3
SYMA2  (via drill 0.61)
  Top 0.254: v73.66,78.74 72.39,77.47 66.04,77.47 66.04,81.28 63.5,83.82 50.8,83.82 50.8,85.09 49.53,86.36 44.45,86.36 44.45,83.82 R37.1
  Bottom 0.254: IC9.16 115.57,78.74 113.03,81.28 111.76,81.28 109.22,78.74 102.87,78.74 101.6,77.47 91.44,77.47 90.17,78.74 v73.66,78.74
SYNCO
  Top 0.254: IC9.11 124.46,66.04 124.46,74.93 127,77.47 SW4.3 125.73,78.74 118.11,86.36 118.11,90.17 113.03,95.25 JP16.1 | R28.1 153.67,62.23 CONN9.P$1 153.67,57.15 147.32,50.8 147.32,30.48 146.05,29.21 146.05,15.24 139.7,15.24 135.89,11.43 SW5.3
  Bottom 0.254: IC9.11 121.92,66.04 129.54,58.42 132.08,58.42 134.62,60.96 139.7,60.96 R28.1
TC1
  Top 0.254: IC9.5 109.22,68.58 109.22,60.96 105.41,57.15 102.87,57.15 102.87,62.23 96.52,68.58 96.52,74.93 92.71,78.74 92.71,80.01 SW6.A
TC2
  Bottom 0.254: C7.2 81.28,63.5 83.82,63.5 | 83.82,63.5 C8.2 | 87.63,64.77 C9.2 | 87.63,64.77 85.09,64.77 83.82,63.5 | 92.71,64.77 C10.2 | 87.63,64.77 92.71,64.77 | IC9.6 97.79,66.04 96.52,64.77 92.71,64.77
TO_BOOSTER  (via drill 0.61)
  Top 0.254: IC1.5 36.83,54.61 v36.83,63.5 | v60.96,73.66 63.5,76.2 63.5,80.01 SW1.A
  Bottom 0.254: v36.83,63.5 44.45,71.12 58.42,71.12 v60.96,73.66
TR1
  Top 0.254: D6.A 99.06,49.53 99.06,40.64 97.79,39.37 97.79,25.4 95.25,22.86 95.25,20.32 96.52,19.05 96.52,17.78 90.17,11.43 90.17,10.16 86.36,10.16 SW2.A
  Bottom 0.254: D6.A 104.14,57.15 105.41,57.15 111.76,63.5 IC9.7
TR2
  Top 0.254: 105.41,52.07 D7.A | 105.41,52.07 105.41,53.34 IC9.8 | 105.41,52.07 101.6,55.88 92.71,55.88 90.17,53.34 90.17,17.78 93.98,17.78 SW2.C
V+  (via drill 0.61)
  Bottom 0.762: v148.59,26.67 R25.2 | v77.47,16.51 76.2,15.24 v69.85,15.24
  pour Top: 0,100.33 160.02,100.33 160.02,0 0,0
V-  (via drill 0.61)
  Top 0.762: v142.24,55.88 v142.24,60.96 | v125.73,66.04 127,67.31 C6.2 | Q2.3 44.45,38.1 46.99,40.64 R9.1 52.07,40.64 52.07,48.26 v48.26,52.07
  Top 0.813: CONN4.P$1 7.62,10.16 10.16,12.7 C3.-
  pour Bottom: 0,100.33 160.02,100.33 160.02,0 0,0
WAVE  (via drill 0.61)
  Top 0.254: v135.89,58.42 135.89,77.47 133.35,77.47 SW4.A
  Bottom 0.254: IC5.3 68.58,53.34 82.55,53.34 85.09,50.8 88.9,50.8 90.17,49.53 90.17,45.72 97.79,45.72 101.6,49.53 101.6,53.34 104.14,53.34 107.95,57.15 135.89,57.15 | 135.89,57.15 146.05,57.15 153.67,49.53 CONN10.P$1 | 135.89,57.15 v135.89,58.42
WAVE_ADC
  Top 0.254: 62.23,49.53 IC5.1 54.61,57.15 54.61,77.47 57.15,80.01 SW1.3 | 62.23,49.53 62.23,45.72 R12.1 | 62.23,49.53 IC5.2
  Bottom 0.254: JP16.2 115.57,95.25 114.3,93.98 102.87,93.98 92.71,83.82 59.69,83.82 57.15,81.28 SW1.3
WAVE_MAX  (via drill 0.61)
  Top 0.254: IC6.2 IC6.1 39.37,48.26 39.37,77.47 34.29,82.55 34.29,97.79 101.6,97.79 v107.95,91.44 | v121.92,93.98 120.65,92.71 v120.65,91.44
  Bottom 0.254: JP16.3 118.11,95.25 119.38,93.98 v121.92,93.98 | v107.95,91.44 v120.65,91.44
WAVEA1
  Top 0.254: IC9.14 123.19,73.66 123.19,80.01 121.92,81.28 R36.3
WAVEA2
  Bottom 0.254: IC9.13 130.81,71.12 140.97,81.28 140.97,85.09 SW4.C

### Text on the board
tPlace: Analog Function Generator | by Clifford Wolf (Dez. 2010)